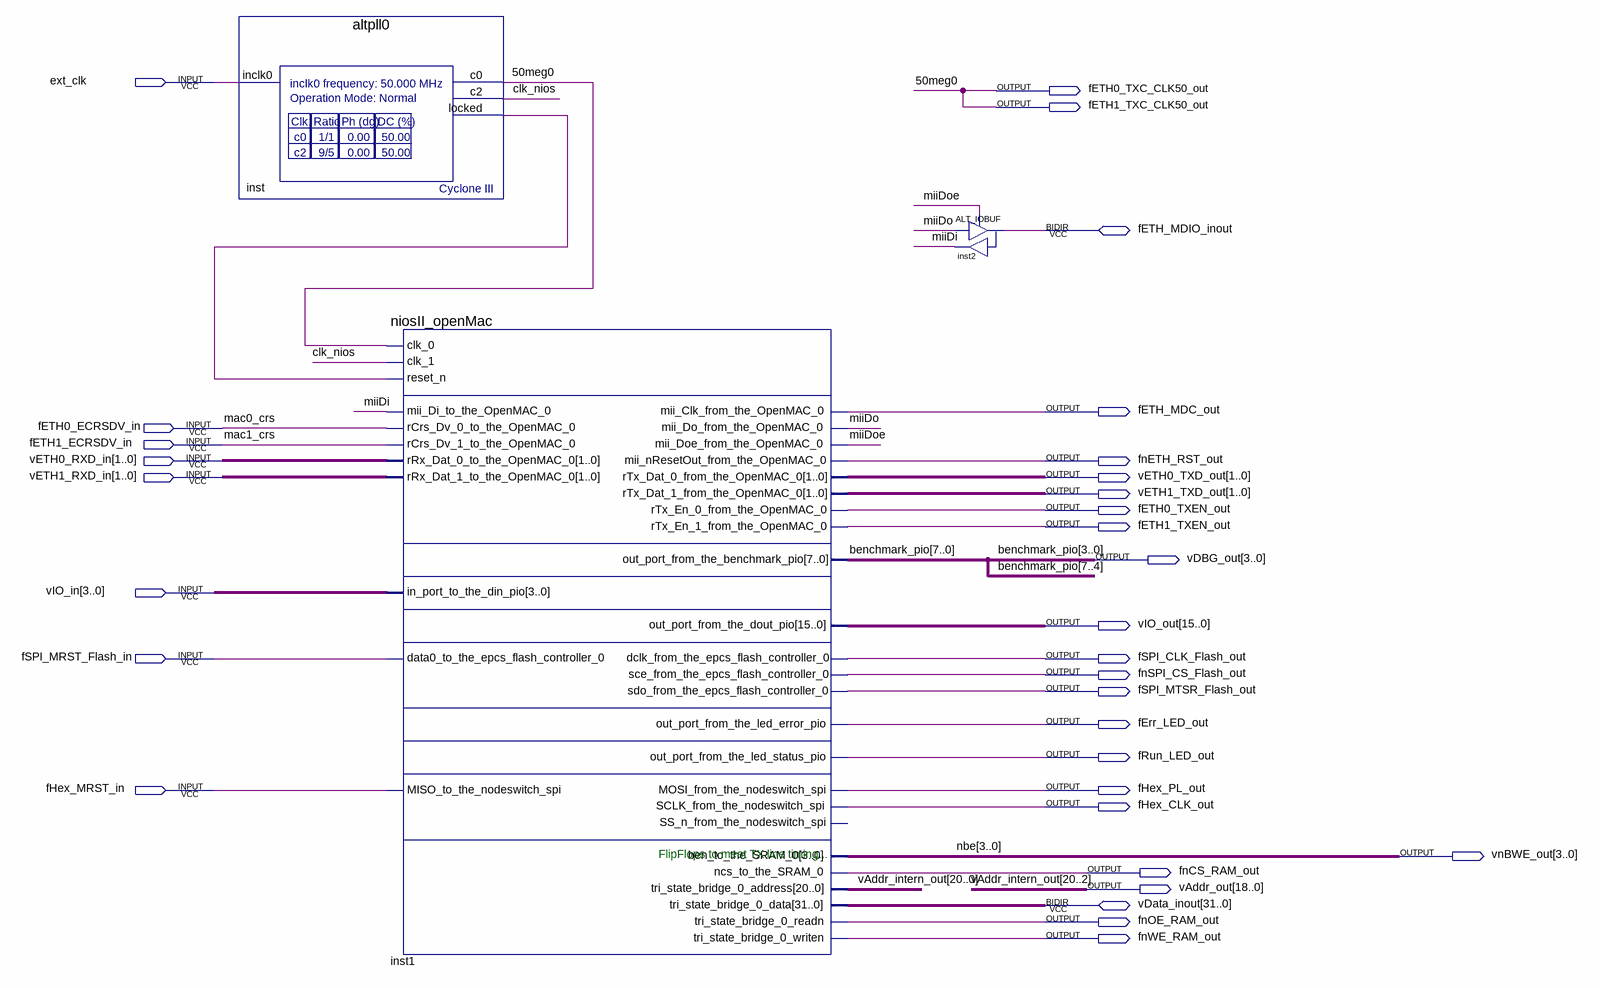
[diagram p0: schematic sheet]
// Quartus schematic nios_pll.bdf as structural Verilog: 3 symbols, 32 pins
module nios_pll (
  input  ext_clk,
  input  fETH0_ECRSDV_in,
  input  fETH1_ECRSDV_in,
  input  [1:0] vETH0_RXD_in,
  input  [1:0] vETH1_RXD_in,
  input  [3:0] vIO_in,
  input  fSPI_MRST_Flash_in,
  input  fHex_MRST_in,
  inout  fETH_MDIO_inout,
  inout  [31:0] vData_inout,
  output fETH0_TXC_CLK50_out,
  output fETH1_TXC_CLK50_out,
  output fETH_MDC_out,
  output fnETH_RST_out,
  output [1:0] vETH0_TXD_out,
  output [1:0] vETH1_TXD_out,
  output fETH0_TXEN_out,
  output fETH1_TXEN_out,
  output [3:0] vDBG_out,
  output [15:0] vIO_out,
  output fSPI_CLK_Flash_out,
  output fnSPI_CS_Flash_out,
  output fSPI_MTSR_Flash_out,
  output fErr_LED_out,
  output fRun_LED_out,
  output fHex_PL_out,
  output fHex_CLK_out,
  output [3:0] vnBWE_out,
  output fnCS_RAM_out,
  output [18:0] vAddr_out,
  output fnOE_RAM_out,
  output fnWE_RAM_out
);

  wire clk_nios, inst_locked, miiDi, miiDo, miiDoe;
  wire [1:0] vAddr_intern_out;
  wire [7:4] benchmark_pio;

  altpll0 inst (.inclk0(ext_clk), .c0(fETH0_TXC_CLK50_out), .c2(clk_nios), .locked(inst_locked));
  niosII_openMac inst1 (
    .clk_0(fETH0_TXC_CLK50_out), .clk_1(clk_nios), .reset_n(inst_locked), .mii_Di_to_the_OpenMAC_0(miiDi),
    .rCrs_Dv_0_to_the_OpenMAC_0(fETH0_ECRSDV_in), .rCrs_Dv_1_to_the_OpenMAC_0(fETH1_ECRSDV_in),
    .rRx_Dat_0_to_the_OpenMAC_0(vETH0_RXD_in), .rRx_Dat_1_to_the_OpenMAC_0(vETH1_RXD_in),
    .in_port_to_the_din_pio(vIO_in), .data0_to_the_epcs_flash_controller_0(fSPI_MRST_Flash_in),
    .MISO_to_the_nodeswitch_spi(fHex_MRST_in), .mii_Clk_from_the_OpenMAC_0(fETH_MDC_out),
    .mii_Do_from_the_OpenMAC_0(miiDo), .mii_Doe_from_the_OpenMAC_0(miiDoe),
    .mii_nResetOut_from_the_OpenMAC_0(fnETH_RST_out), .rTx_Dat_0_from_the_OpenMAC_0(vETH0_TXD_out),
    .rTx_Dat_1_from_the_OpenMAC_0(vETH1_TXD_out), .rTx_En_0_from_the_OpenMAC_0(fETH0_TXEN_out),
    .rTx_En_1_from_the_OpenMAC_0(fETH1_TXEN_out),
    .out_port_from_the_benchmark_pio({benchmark_pio, vDBG_out}), .out_port_from_the_dout_pio(vIO_out),
    .dclk_from_the_epcs_flash_controller_0(fSPI_CLK_Flash_out),
    .sce_from_the_epcs_flash_controller_0(fnSPI_CS_Flash_out),
    .sdo_from_the_epcs_flash_controller_0(fSPI_MTSR_Flash_out),
    .out_port_from_the_led_error_pio(fErr_LED_out), .out_port_from_the_led_status_pio(fRun_LED_out),
    .MOSI_from_the_nodeswitch_spi(fHex_PL_out), .SCLK_from_the_nodeswitch_spi(fHex_CLK_out),
    .ben_to_the_SRAM_0(vnBWE_out), .ncs_to_the_SRAM_0(fnCS_RAM_out),
    .tri_state_bridge_0_address({vAddr_out, vAddr_intern_out}), .tri_state_bridge_0_readn(fnOE_RAM_out),
    .tri_state_bridge_0_writen(fnWE_RAM_out), .tri_state_bridge_0_data(vData_inout));  // open: SS_n_from_the_nodeswitch_spi
  ALT_IOBUF inst2 (.i(miiDo), .oe(miiDoe), .o(miiDi), .io(fETH_MDIO_inout));

  assign fETH1_TXC_CLK50_out = fETH0_TXC_CLK50_out;

  // Other names for the same wires on the sheet: benchmark_pio[3:0] = vDBG_out; 50meg0 = fETH0_TXC_CLK50_out;
  //   mac0_crs = fETH0_ECRSDV_in; mac1_crs = fETH1_ECRSDV_in; nbe[3:0] = vnBWE_out;
  //   vAddr_intern_out[20:2] = vAddr_out

  // Notes on the sheet:
  //   FlipFlops to meet TX line timing...
endmodule
